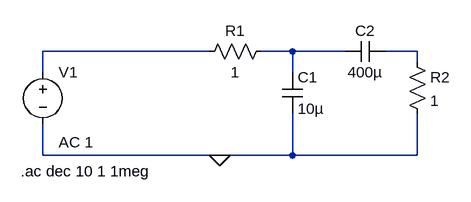
[diagram p0: schematic ex4a.asc]
ex4a.asc, the LTspice schematic file:
Version 4
SHEET 1 880 680
WIRE 176 80 -80 80
WIRE 304 80 256 80
WIRE 384 80 304 80
WIRE 496 80 448 80
WIRE 496 96 496 80
WIRE -80 112 -80 80
WIRE 304 112 304 80
WIRE -80 240 -80 192
WIRE 192 240 -80 240
WIRE 304 240 304 176
WIRE 304 240 192 240
WIRE 496 240 496 176
WIRE 496 240 304 240
FLAG 192 240 0
SYMBOL res 160 96 R270
WINDOW 0 32 56 VTop 2
WINDOW 3 0 56 VBottom 2
SYMATTR InstName R1
SYMATTR Value 1
SYMBOL cap 288 112 R0
SYMATTR InstName C1
SYMATTR Value 10µ
SYMBOL res 480 80 R0
SYMATTR InstName R2
SYMATTR Value 1
SYMBOL cap 384 96 R270
WINDOW 0 32 32 VTop 2
WINDOW 3 0 32 VBottom 2
SYMATTR InstName C2
SYMATTR Value 400µ
SYMBOL voltage -80 96 R0
WINDOW 123 24 124 Left 2
WINDOW 39 0 0 Left 2
SYMATTR InstName V1
SYMATTR Value ""
SYMATTR Value2 AC 1
TEXT -114 264 Left 2 !.ac dec 10 1 1meg

The netlist it stands for:
* ex4a.asc
R1 N001 N002 1
C1 N002 0 10µ
R2 N003 0 1
C2 N002 N003 400µ
V1 N001 0 AC 1
.ac dec 10 1 1meg
.backanno
.end